# Altium schematic sheet RELAY_SMT_5V_IM03GR.SchDoc: Power Control
size A4; DocumentNumber: 14; Revision: 5; SheetNumber: 15; SheetTotal: 77; Organization: Altium Limited.; Address1: Level 3, 12a Rodborough Rd; Address2: Frenchs Forest 2086; Address3: NSW; Address4: AUSTRALIA
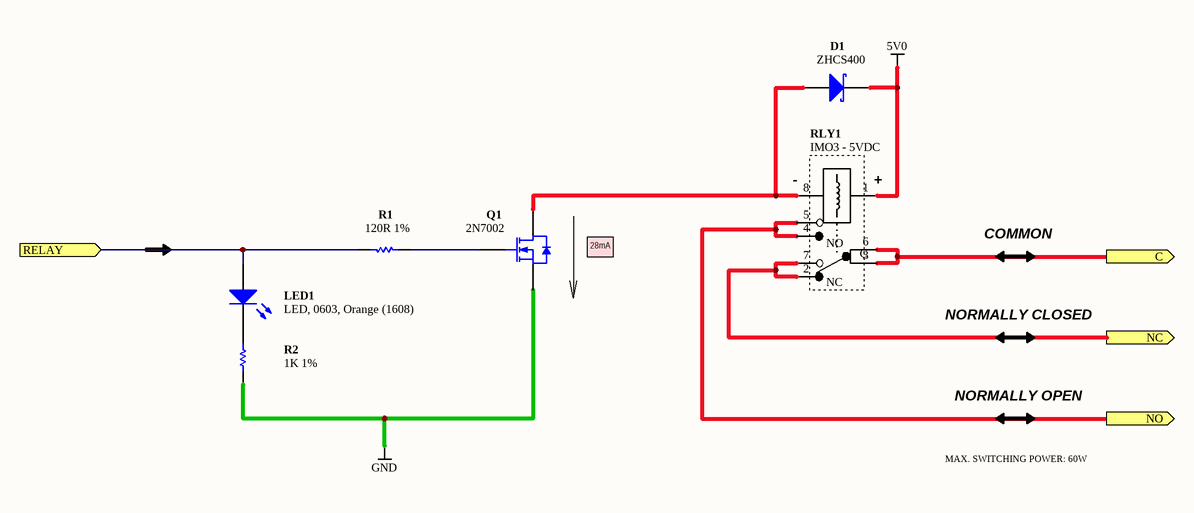
[diagram p0: RELAY_SMT_5V_IM03GR.SchDoc]

## Parts
D1  ZHCS400  [SOD323]
LED1  LED, 0603, Orange (1608)  [0603LED_ORANGE]
Q1  2N7002  [SOT95P230-3D]
R1  120R 1%  [RESC1005-STAR]
R2  1K 1%  [RESC1005-STAR]
RLY1  IMO3 - 5VDC  [IM03GR]

## Ports
C (out), NC (out), NO (out), RELAY (in)

## Nets
5V0: D1.2(K) RLY1.1(+)
GND: Q1.3(S) R2.1
C: RLY1.3 RLY1.6 ; port C
NC: RLY1.2 RLY1.7 ; port NC
NO: RLY1.4 RLY1.5 ; port NO
RELAY: LED1.1(A) R1.1 ; port RELAY
NetD1_1: D1.1(A) Q1.2(D) RLY1.8(-)
NetLED1_2: LED1.2(K) R2.2
NetQ1_1: Q1.1(G) R1.2

## Notes on the sheet
- (near RLY1) -
- (near RLY1) +
- 28mA
- COMMON
- NORMALLY CLOSED
- NORMALLY OPEN
- MAX. SWITCHING POWER: 60W
- Sheet Title
- Project Title
- Size:
- Date:
- A4
- Assy:
- Time:
- Revision:
- Sheet
- of
- File:
- (in symbol D-313-0001) NO; C; NC

## Library data of the parts
D1 = D-151-0004: Schottky Diode, 400mA; Rated Voltage: mV; Max Forward Current: 400 mA; Mounting Technology: Surface Mount; Status: Unreleased; Category: Diode-Schottky
LED1 = D-153-0006: Brightness: 200mcd; Peak Wave Length: nm; Category: LED; Color: Orange; Mounting Technology: Surface Mount; Status: Production
Q1 = D-158-0002: N-channel Enhancement Mode Field-effect Transistor; Transistor Type: NPN; Mounting Technology: Surface Mount; Status: Unreleased; Category: Transistor-FET
R1 = D-100-0126: Resistor, 120R 1% 0402 (1005); Power Rating: 63 mW; Category: Resistor; Mounting Technology: Surface Mount; Resistance: 120 R; Status: Production; Tolerance: 1 %
R2 = D-100-0121: Resistor, 1K 1% 0402 (1005); Power Rating: 63 mW; Category: Resistor; Mounting Technology: Surface Mount; Resistance: 1 K; Status: Production; Tolerance: 1 %
RLY1 = D-313-0001: Relay, Tyco IM03GR; Rated Voltage: mV; Switch Type: DPDT; Mounting Technology: Surface Mount; Status: Unreleased; Category: Relay